# Altium schematic sheet Sheet1.SchDoc
size A4; SheetNumber: 1; SheetTotal: 1
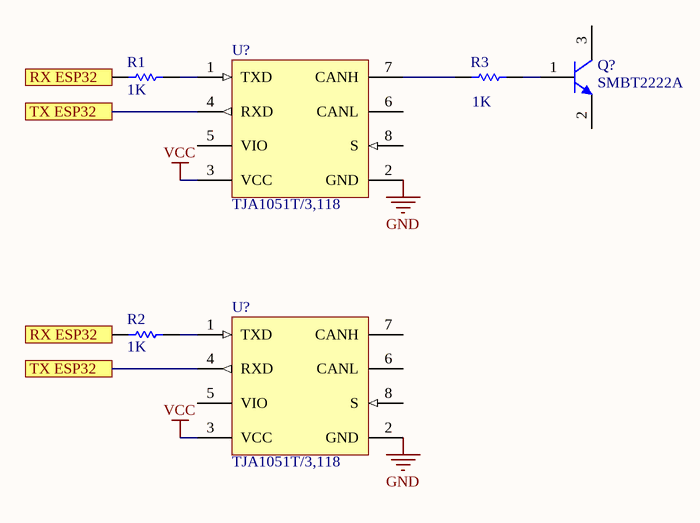
[diagram p0: Sheet1.SchDoc]

## Parts
(Parts that share a designator on the sheet are numbered #1, #2 ... from top to bottom, then left to right.)
Q?  SMBT2222A  [INF-SOT23_L]
R1  value 1K  (hidden comment: Resistor)
R2  value 1K  (hidden comment: Resistor)
R3  value 1K  (hidden comment: Resistor)
U?#1  TJA1051T/3,118  [NXP-SOIC-8_L]
U?#2  TJA1051T/3,118  [NXP-SOIC-8_L]

## Ports
RX ESP32, TX ESP32

## Nets
GND: U?#1.2(GND) U?#2.2(GND)
VCC: U?#1.3(VCC) U?#2.3(VCC)
RX ESP32: R1.1 R2.1 ; port RX ESP32
TX ESP32: U?#1.4(RXD) U?#2.4(RXD) ; port TX ESP32
NetQ?_1: Q?.1(B) R3.2
NetR1_2: R1.2 U?#1.1(TXD)
NetR2_2: R2.2 U?#2.1(TXD)
NetR3_1: R3.1 U?#1.7(CANH)

Not connected (* = marked no-connect by the designer): Q? 2(E) 3(C); U?#1 5(VIO) 6(CANL) 8(S); U?#2 5(VIO) 6(CANL) 7(CANH) 8(S)

## Library data of the parts
Q? = CMP-1178-00004-1: NPN Silicon Switching Transistor, 40 V VCEO, 600 mA IC, SOT23, Reel, Green; Manufacturer: Infineon; IC (max): 600 mA; IC: 150 mA; VCE: 10 V; VCEO (max): 40 V; VCBO (max): 75 V; VEBO (max): 6 V; ICBO (max): 10 nA; Green: TRUE; Mounting Technology: Surface Mount; PackageDescription: 3-Pin Small Outline Transistor Package, 1.3 x 2.9 mm Body, 0.95 mm Pitch; ComponentLink1Description: Manufacturer URL; ComponentLink3URL: http://www.infineon.com/dgdl/SOT23-Package_Overview.pdf?folderId=db3a30431936bc4b0119532290053c66&fileId=db3a30431936bc4b0119533468123c85; PackageVersion: Apr-08; VCE (max): 10 V; ComponentLink1URL: http://www.infineon.com/; Packing: Reel; ComponentLink2URL: http://www.infineon.com/dgdl/smbt2222a_mmbt2222a.pdf?folderId=db3a30431441fb5d011445fab851018e&fileId=db3a30431441fb5d011445fbaff0018f; PartNumber: SMBT2222A; PackageReference: SOT23; ComponentLink3Description: Package Specification; Polarity: NPN; ComponentLink2Description: Datasheet
R1-R3 = Resistor: TC1: 0; SimulationGenericComponent: True; TC2: 0
U?#1 U?#2 = CMP-2000-07245-1: High-Speed CAN Transceiver, 3 to 5 V, 8-Pin SOIC (SOT96-1), RoHS, Tape and Reel; Manufacturer: NXP; Power Down Mode: Normal/Silent; Rad Hardened: No; Number of Transceivers: 1; Supply Current: 70mA; Operating Supply Voltage (Max): 5.5V; Operating Supply Voltage (Typ): 5V; Operating Supply Voltage (Min): 4.5V; Standard Supported: ISO11898-2; Data Rate: 1Mbps; DELETED: Compliant; Operating Temperature (Min): -40C; Datasheet Version: Rev. 7, 01/2015; Pin Count: 8; Operating Temperature (Max): 125C; Package Description: 8-Pin Small Outline Integrated Circuit, Body 4.9 x 3.9 mm, Pitch 1.27 mm; Category: Transceiver; Packaging: TapeandReel; Mounting: SurfaceMount; Package Reference: SOT96-1; Operating Temperature Classification: Automotive; Mounting Technology: SurfaceMount; Package Type: SO; Manufacturer URL: http://www.nxp.com/; Datasheet URL: http://www.nxp.com/documents/data_sheet/TJA1051.pdf